# Altium project STM32H750-MotherBoard.PrjPcb
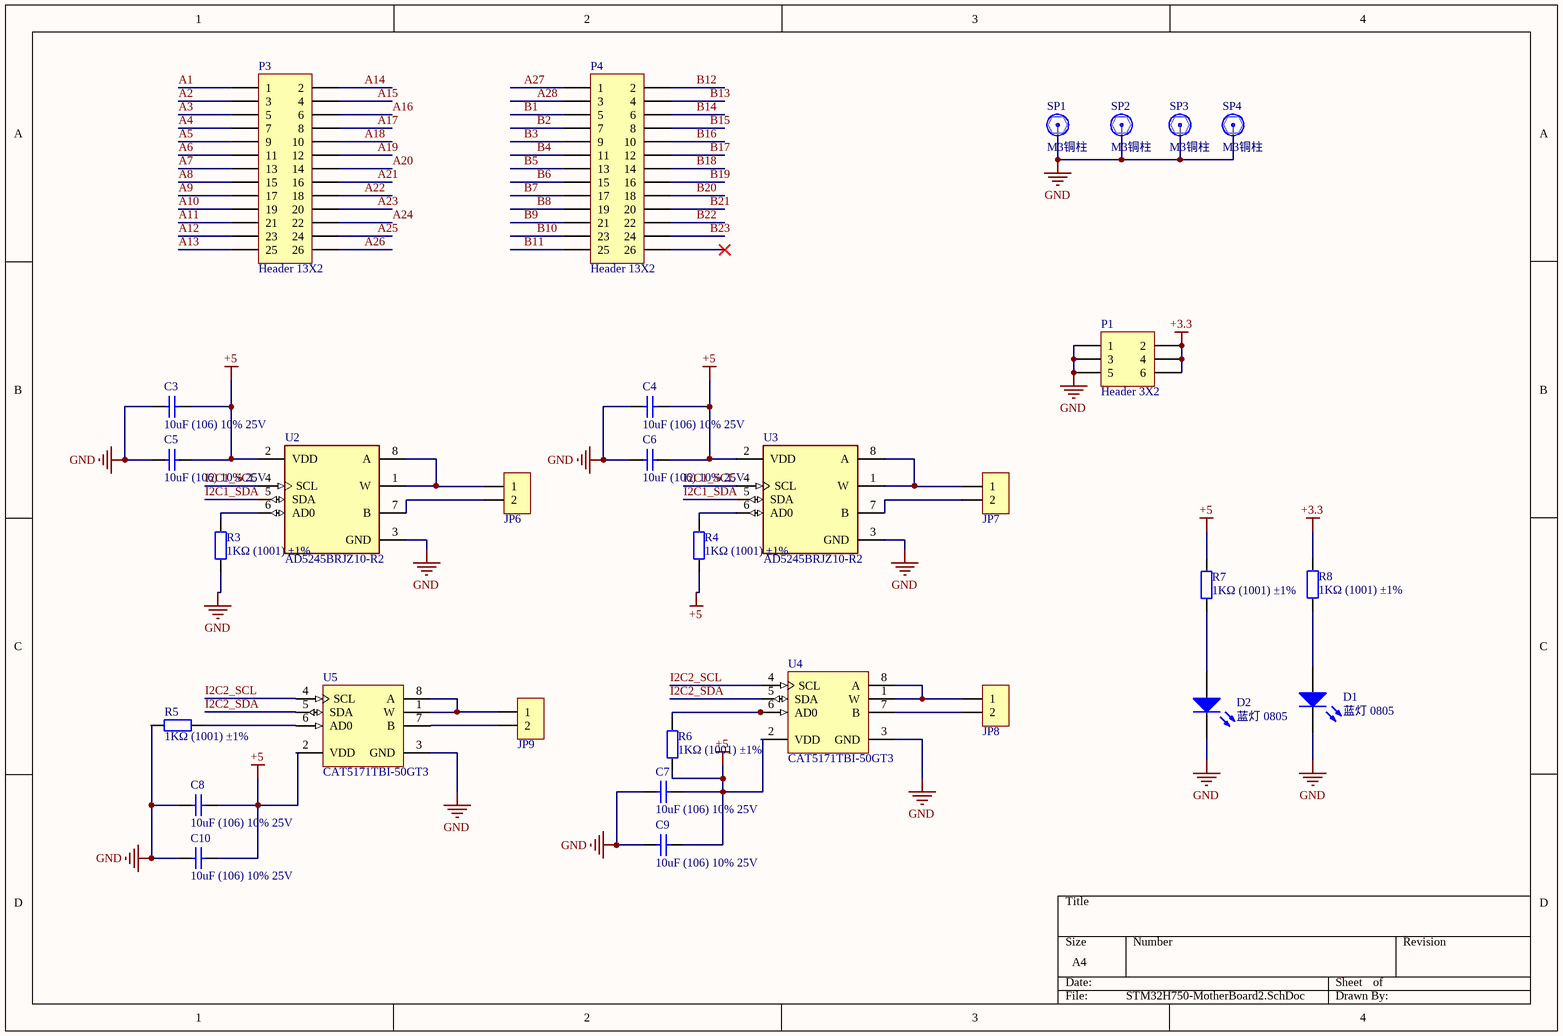
[diagram p0: STM32H750-MotherBoard2.SchDoc]
2 sheets, 45 parts. Net scope: global (net labels, ports and power ports of the same name join across sheets).
Board file: STM32H750-MotherBoard.PcbDoc
Sheets:
  STM32H750-MotherBoard2.SchDoc
  STM32H750-MotherBoard1.SchDoc

## Sheet STM32H750-MotherBoard2.SchDoc
size A4; DocumentNumber: 2; SheetNumber: 2; SheetTotal: 2

### Parts
C3  10uF (106) 10% 25V  [0805_C]
C4  10uF (106) 10% 25V  [0805_C]
C5  10uF (106) 10% 25V  [0805_C]
C6  10uF (106) 10% 25V  [0805_C]
C7  10uF (106) 10% 25V  [0805_C]
C8  10uF (106) 10% 25V  [0805_C]
C9  10uF (106) 10% 25V  [0805_C]
C10  10uF (106) 10% 25V  [0805_C]
D1  蓝灯 0805  [0805_LED_S1]
D2  蓝灯 0805  [0805_LED_S1]
JP6  HDR-1X2  [XH2.54-LI-2P]  (value not drawn)
JP7  HDR-1X2  [XH2.54-LI-2P]  (value not drawn)
JP8  HDR-1X2  [XH2.54-LI-2P]  (value not drawn)
JP9  HDR-1X2  [XH2.54-LI-2P]  (value not drawn)
P1  Header 3X2  [HDR2X3]
P3  Header 13X2  [HDR2X13]
P4  Header 13X2  [HDR2X13]
R3  1KΩ (1001) ±1%  [0805_R]
R4  1KΩ (1001) ±1%  [0805_R]
R5  1KΩ (1001) ±1%  [0805_R]
R6  1KΩ (1001) ±1%  [0805_R]
R7  1KΩ (1001) ±1%  [0805_R]
R8  1KΩ (1001) ±1%  [0805_R]
SP1  M3铜柱  [M3x4_L]
SP2  M3铜柱  [M3x4_L]
SP3  M3铜柱  [M3x4_L]
SP4  M3铜柱  [M3x4_L]
U2  AD5245BRJZ10-R2  [FP-RJ-8-IPC_C]
U3  AD5245BRJZ10-R2  [FP-RJ-8-IPC_C]
U4  CAT5171TBI-50GT3  [ONSC-SOT23-8-527AK-01_N]
U5  CAT5171TBI-50GT3  [ONSC-SOT23-8-527AK-01_N]

### Nets
+3.3: P1.2 P1.4 P1.6 R8.2
+5: C3.2 C4.2 C5.2 C6.2 C7.2 C8.2 C9.2 C10.2 R4.1 R6.1 R7.2 U2.2(VDD) U3.2(VDD) U4.2(VDD) U5.2(VDD)
GND: C3.1 C4.1 C5.1 C6.1 C7.1 C8.1 C9.1 C10.1 D1.K D2.K P1.1 P1.3 P1.5 R3.1 R5.1 SP1.1 SP2.1 SP3.1 SP4.1 U2.3(GND) U3.3(GND) U4.3(GND) U5.3(GND)
A1: P3.1
A2: P3.3
A3: P3.5
A4: P3.7
A5: P3.9
A6: P3.11
A7: P3.13
A8: P3.15
A9: P3.17
A10: P3.19
A11: P3.21
A12: P3.23
A13: P3.25
A14: P3.2
A15: P3.4
A16: P3.6
A17: P3.8
A18: P3.10
A19: P3.12
A20: P3.14
A21: P3.16
A22: P3.18
A23: P3.20
A24: P3.22
A25: P3.24
A26: P3.26
A27: P4.1
A28: P4.3
B1: P4.5
B2: P4.7
B3: P4.9
B4: P4.11
B5: P4.13
B6: P4.15
B7: P4.17
B8: P4.19
B9: P4.21
B10: P4.23
B11: P4.25
B12: P4.2
B13: P4.4
B14: P4.6
B15: P4.8
B16: P4.10
B17: P4.12
B18: P4.14
B19: P4.16
B20: P4.18
B21: P4.20
B22: P4.22
B23: P4.24
I2C1_SCL: U2.4(SCL) U3.4(SCL)
I2C1_SDA: U2.5(SDA) U3.5(SDA)
I2C2_SCL: U4.4(SCL) U5.4(SCL)
I2C2_SDA: U4.5(SDA) U5.5(SDA)
NetD1_A: D1.A R8.1
NetD2_A: D2.A R7.1
NetJP6_1: JP6.1 U2.1(W) U2.8(A)
NetJP6_2: JP6.2 U2.7(B)
NetJP7_1: JP7.1 U3.1(W) U3.8(A)
NetJP7_2: JP7.2 U3.7(B)
NetJP8_1: JP8.1 U4.1(W) U4.8(A)
NetJP8_2: JP8.2 U4.7(B)
NetJP9_1: JP9.1 U5.1(W) U5.8(A)
NetJP9_2: JP9.2 U5.7(B)
NetR3_2: R3.2 U2.6(AD0)
NetR4_2: R4.2 U3.6(AD0)
NetR5_2: R5.2 U5.6(AD0)
NetR6_2: R6.2 U4.6(AD0)

Not connected (* = marked no-connect by the designer): P4 26*

### Library data of the parts
C3-C10 = 0805 10uF (106) 10% 25V: 贴片电容; ComponentLink1Description: 供应商链接; ComponentLink1URL: http://www.szlcsc.com/product/details_16532.html; Package: 0805; Supplier: LC; SuppliersPartNumber: C15850
D1 D2 = 0805 蓝灯: 发光二极管; ComponentLink1Description: 供应商链接; ComponentLink1URL: http://www.szlcsc.com/product/details_2666.html; Package: 0805; Supplier: LC; SuppliersPartNumber: C2293
JP6-JP9 = Header 2: 2P接插件; BOM名称: 2P接插件
P1 = Header 3X2: Header, 3-Pin, Dual row; LatestRevisionDate: 17-Jul-2002; LatestRevisionNote: Re-released for DXP Platform.; Publisher: Altium Limited
P3 P4 = Header 13X2: Header, 13-Pin, Dual row; LatestRevisionDate: 17-Jul-2002; LatestRevisionNote: Re-released for DXP Platform.; Publisher: Altium Limited
R3-R8 = 0805 1KΩ (1001) 1%: 贴片电阻; ComponentLink1Description: 供应商链接; ComponentLink1URL: http://www.szlcsc.com/product/details_18201.html; Package: 0805; Supplier: LC; SuppliersPartNumber: C17513
SP1-SP4 = 铜柱小焊盘: 铜柱; BOM名称: 铜柱
U2 U3 = CMP-09083-000005-1: IC DGT POT 10KOHM 256TAP SOT23-8; Manufacturer: Analog Devices; Interface: I2C; Nominal Resistance: 10kΩ; Nominal Supply Current: 3uA; Tolerance: 30%; Max Junction Temp: +150°C; Standoff Height: 0.05mm; Number Of Taps: 256; Number Of Circuits: 1; Min Supply Voltage: 2.7V; Max Supply Voltage: 5.5V; Temperature Coefficient: 45ppm/°C; Footprint Url: https://www.analog.com/media/en/package-pcb-resources/package/pkg_pdf/sot-23rj/RJ_8.pdf; Height: 1.45mm; Temperature Range Low: -40°C; Category: IC; Temperature: -40°C to +125°C; ComponentLink2URL: https://www.analog.com/media/en/technical-documentation/data-sheets/AD5245.pdf; Automotive: No; Lead Free: Yes; ComponentLink2Description: Datasheet; Device Class L2: Data Converter ICs; Digikey Description: IC DGT POT 10KOHM 256TAP SOT23-8; Manufacturer Part Number: AD5245BRJZ10-R2; Package: RJ-8; Octopart: https://octopart.com/ad5245brjz10-r2-analog+devices-446714; Ipc Land Pattern Name: SOT65P280X120-8; Device Class L1: Integrated Circuits (ICs); RoHS: TRUE; Temperature Range High: +125°C; Device Class L3: Digital Potentiometers; Mouser Description: Digital Potentiometer ICs IC 256-pos I2C
U4 U5 = CMP-1317-00202-1: 256-Position I2C Compatible Digital Potentiometer (POT), -40 to 85 degC, 8-Pin SOT23, Pb-Free, Tape and Reel; Manufacturer: On Semiconductor; # of Pots: 1; VDD Max (V): 5.5; # of Taps: 256; Code_JEDEC: MO-178; RoHS: TRUE; ComponentLink1URL: http://www.onsemi.com/; ComponentLink3URL: http://www.onsemi.com/pub_link/Collateral/527AK.PDF; PackageDescription: 8-Pin Small Outline Transistor, Body 2.9 x 1.6 mm, Pitch 0.65 mm; ComponentLink3Description: Package Specification; PackageReference: SOT23-8-527AK-01; ComponentLink1Description: Manufacturer URL; PartNumber: CAT5171TBI-50GT3; PackageVersion: Rev. A, 03/2009; Packing: Tape and Reel; DatasheetVersion: Rev. 2; Mounting Technology: Surface Mount; ComponentLink2URL: http://www.onsemi.com/pub_link/Collateral/CAT5171-D.PDF; Control Interface: I2C; Type: Potentiometer; ComponentLink2Description: Datasheet

## Sheet STM32H750-MotherBoard1.SchDoc
size A4; DocumentNumber: 1; SheetNumber: 1; SheetTotal: 2
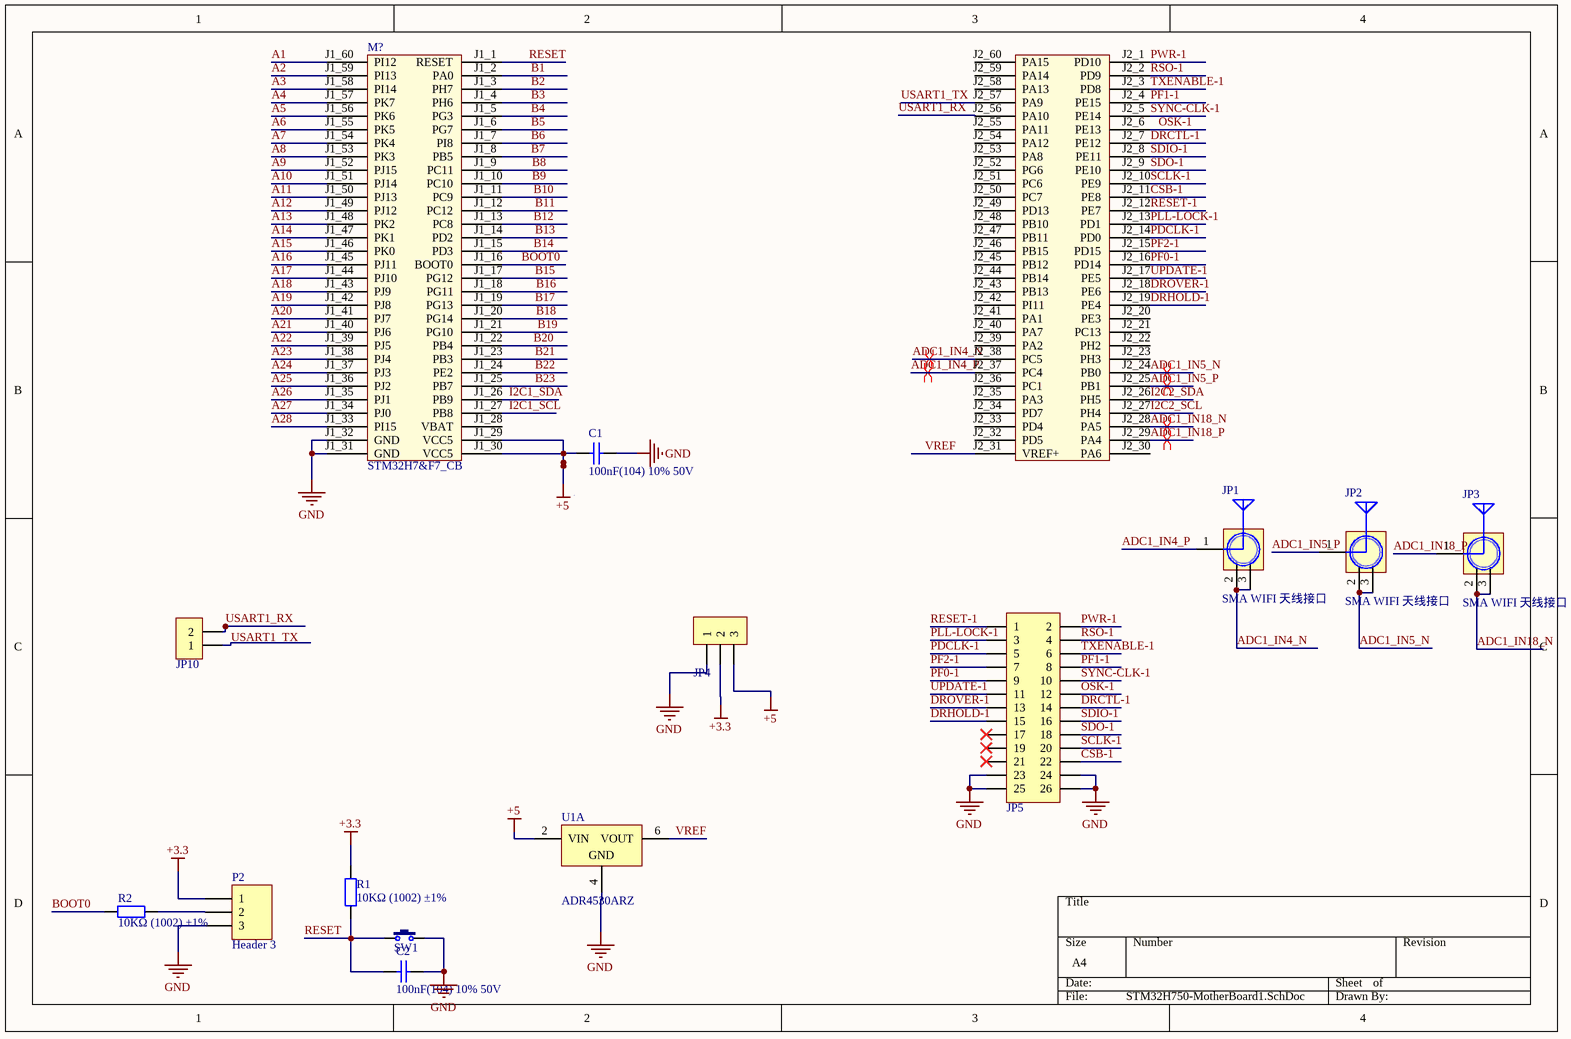
[diagram p1: STM32H750-MotherBoard1.SchDoc]

### Parts
C1  100nF(104) 10% 50V  [0805_C]
C2  100nF(104) 10% 50V  [0805_C]
JP1  SMA WIFI 天线接口  [SMA-KE]
JP2  SMA WIFI 天线接口  [SMA-KE]
JP3  SMA WIFI 天线接口  [SMA-KE]
JP4  HDR-1X3  [XH2.54-WI-3P]  (value not drawn)
JP5  Header 2X11  [IDC2.54-LI-2x13P]  (value not drawn)
JP10  HDR-1X2  [XH2.54-LI-2P]  (value not drawn)
M?  STM32H7&F7_CB  [STM32H7&F7_CB]
P2  Header 3  [HDR1X3]
R1  10KΩ (1002) ±1%  [0805_R]
R2  10KΩ (1002) ±1%  [0805_R]
SW1  3x6x5  [TSW SMD-3*6*2.5]  (value not drawn)
U1  ADR4530ARZ  [ADI-R-8_L]  (part A of 2)

### Nets
+3.3: JP4.2 P2.1 R1.2
+5: C1.2 JP4.3 M?.J1_29(VCC5) M?.J1_30(VCC5) U1.2(VIN)
GND: C1.1 C2.1 JP4.1 JP5.23 JP5.24 JP5.25 JP5.26 M?.J1_31(GND) M?.J1_32(GND) P2.3 SW1.2 U1.4(GND)
A1: M?.J1_60(PI12)
A2: M?.J1_59(PI13)
A3: M?.J1_58(PI14)
A4: M?.J1_57(PK7)
A5: M?.J1_56(PK6)
A6: M?.J1_55(PK5)
A7: M?.J1_54(PK4)
A8: M?.J1_53(PK3)
A9: M?.J1_52(PJ15)
A10: M?.J1_51(PJ14)
A11: M?.J1_50(PJ13)
A12: M?.J1_49(PJ12)
A13: M?.J1_48(PK2)
A14: M?.J1_47(PK1)
A15: M?.J1_46(PK0)
A16: M?.J1_45(PJ11)
A17: M?.J1_44(PJ10)
A18: M?.J1_43(PJ9)
A19: M?.J1_42(PJ8)
A20: M?.J1_41(PJ7)
A21: M?.J1_40(PJ6)
A22: M?.J1_39(PJ5)
A23: M?.J1_38(PJ4)
A24: M?.J1_37(PJ3)
A25: M?.J1_36(PJ2)
A26: M?.J1_35(PJ1)
A27: M?.J1_34(PJ0)
A28: M?.J1_33(PI15)
ADC1_IN4_N: JP1.2(GND) JP1.3(GND) M?.J2_38(PC5)
ADC1_IN4_P: JP1.1(ANT) M?.J2_37(PC4)
ADC1_IN5_N: JP2.2(GND) JP2.3(GND) M?.J2_24(PB0)
ADC1_IN5_P: JP2.1(ANT) M?.J2_25(PB1)
ADC1_IN18_N: JP3.2(GND) JP3.3(GND) M?.J2_28(PA5)
ADC1_IN18_P: JP3.1(ANT) M?.J2_29(PA4)
B1: M?.J1_2(PA0)
B2: M?.J1_3(PH7)
B3: M?.J1_4(PH6)
B4: M?.J1_5(PG3)
B5: M?.J1_6(PG7)
B6: M?.J1_7(PI8)
B7: M?.J1_8(PB5)
B8: M?.J1_9(PC11)
B9: M?.J1_10(PC10)
B10: M?.J1_11(PC9)
B11: M?.J1_12(PC12)
B12: M?.J1_13(PC8)
B13: M?.J1_14(PD2)
B14: M?.J1_15(PD3)
B15: M?.J1_17(PG12)
B16: M?.J1_18(PG11)
B17: M?.J1_19(PG13)
B18: M?.J1_20(PG14)
B19: M?.J1_21(PG10)
B20: M?.J1_22(PB4)
B21: M?.J1_23(PB3)
B22: M?.J1_24(PE2)
B23: M?.J1_25(PB7)
BOOT0: M?.J1_16(BOOT0) R2.1
CSB-1: JP5.22 M?.J2_11(PE8)
DRCTL-1: JP5.14 M?.J2_7(PE12)
DRHOLD-1: JP5.15 M?.J2_19(PE4)
DROVER-1: JP5.13 M?.J2_18(PE6)
I2C1_SCL: M?.J1_27(PB8)
I2C1_SDA: M?.J1_26(PB9)
I2C2_SCL: M?.J2_27(PH4)
I2C2_SDA: M?.J2_26(PH5)
OSK-1: JP5.12 M?.J2_6(PE13)
PDCLK-1: JP5.5 M?.J2_14(PD0)
PF0-1: JP5.9 M?.J2_16(PD14)
PF1-1: JP5.8 M?.J2_4(PE15)
PF2-1: JP5.7 M?.J2_15(PD15)
PLL-LOCK-1: JP5.3 M?.J2_13(PD1)
PWR-1: JP5.2 M?.J2_1(PD10)
RESET: C2.2 M?.J1_1(RESET) R1.1 SW1.1
RESET-1: JP5.1 M?.J2_12(PE7)
RSO-1: JP5.4 M?.J2_2(PD9)
SCLK-1: JP5.20 M?.J2_10(PE9)
SDIO-1: JP5.16 M?.J2_8(PE11)
SDO-1: JP5.18 M?.J2_9(PE10)
SYNC-CLK-1: JP5.10 M?.J2_5(PE14)
TXENABLE-1: JP5.6 M?.J2_3(PD8)
UPDATE-1: JP5.11 M?.J2_17(PE5)
USART1_RX: JP10.2 M?.J2_56(PA10)
USART1_TX: JP10.1 M?.J2_57(PA9)
VREF: M?.J2_31(VREF+) U1.6(VOUT)
NetP2_2: P2.2 R2.2

Not connected (* = marked no-connect by the designer): JP5 17* 19* 21*; M? J1_28(VBAT) J2_20(PE3) J2_21(PC13) J2_22(PH2) J2_23(PH3) J2_30(PA6) J2_32(PD5) J2_33(PD4) J2_34(PD7) J2_35(PA3) J2_36(PC1) J2_39(PA2) J2_40(PA7) J2_41(PA1) J2_42(PI11) J2_43(PB13) J2_44(PB14) J2_45(PB12) J2_46(PB15) J2_47(PB11) J2_48(PB10) J2_49(PD13) J2_50(PC7) J2_51(PC6) J2_52(PG6) J2_53(PA8) J2_54(PA12) J2_55(PA11) J2_58(PA13) J2_59(PA14) J2_60(PA15)

### Layout directives
differential pair: ADC1_IN4_N, ADC1_IN4_P, ADC1_IN5_N, ADC1_IN5_P, ADC1_IN18_N, ADC1_IN18_P

### Library data of the parts
C1 C2 = 0805 100nF(104) 10% 50V: 贴片电容; ComponentLink1Description: 供应商链接; ComponentLink1URL: http://www.szlcsc.com/product/details_50686.html; Package: 0805; Supplier: LC; SuppliersPartNumber: C49678
JP1-JP3 = SMA: SMA-2.4G射频天线接口; BOM名称: SMA-2.4G射频天线接口
JP4 = Header 3: 3P接插件; BOM名称: 3P接插件
JP5 = Header 13X2: 13*2P接插件; BOM名称: 13*2P接插件
JP10 = Header 2: 2P接插件; BOM名称: 2P接插件
M? = STM32H7&F7_CB: H750/F750 Core Board
P2 = Header 3: Header, 3-Pin; LatestRevisionDate: 17-Jul-2002; LatestRevisionNote: Re-released for DXP Platform.; Publisher: Altium Limited
R1 R2 = 0805 10KΩ (1002) 1%: 贴片电阻; ComponentLink1Description: 供应商链接; ComponentLink1URL: http://www.szlcsc.com/product/details_18102.html; Package: 0805; Supplier: LC; SuppliersPartNumber: C17414
SW1 = TSW 3x6: 3x6轻触开关; BOM名称: 3x6轻触开关
U1 = CMP-0784-00168-1: Ultralow Noise, High Accuracy Voltage Reference, 3 V Output, 3 to 15 V Supply, Industrial, 8-pin SOIC (R-8), Tube; Manufacturer: Analog Devices; Vout: 3V; Min V Supply (V): 3; Ref Out TC (ppm/C): 4; Max V Supply (V): 15; Packing: Tube; ComponentLink1Description: Manufacturer URL; Operating Temp Range: -40 to 125 degC; ComponentLink3Description: Package Specification; PackageReference: R-8; ComponentLink1URL: http://www.analog.com/en/index.html; PackageVersion: 060506-A, 06/2006; PartNumber: ADR4530ARZ; Code_JEDEC: MS-012-AA; ComponentLink4URL: Product URL:http://www.analog.com/en/special-linear-functions/voltage-references/adr4530/products/product.html; ComponentLink2URL: http://www.analog.com/static/imported-files/data_sheets/ADR4520_4525_4530_4533_4540_4550.pdf; PackageDescription: 8-Pin Standard Small Outline Package, Body 4.9 x 3.9 mm, Pitch 1.27 mm; ComponentLink2Description: Datasheet; Mounting Technology: Surface Mount; ComponentLink3URL: http://www.analog.com/static/imported-files/packages/PKG_PDF/SOIC_Narrow%20(R)/R_8.pdf; DatasheetVersion: Rev. 0; ComponentLink4Description: URL Link1

## Nets that join several sheets
+3.3: STM32H750-MotherBoard2 (P1.2 P1.4 P1.6 R8.2), STM32H750-MotherBoard1 (JP4.2 P2.1 R1.2)
+5: STM32H750-MotherBoard2 (15 pins), STM32H750-MotherBoard1 (5 pins)
GND: STM32H750-MotherBoard2 (23 pins), STM32H750-MotherBoard1 (12 pins)
A1: STM32H750-MotherBoard2 (P3.1), STM32H750-MotherBoard1 (M?.J1_60)
A2: STM32H750-MotherBoard2 (P3.3), STM32H750-MotherBoard1 (M?.J1_59)
A3: STM32H750-MotherBoard2 (P3.5), STM32H750-MotherBoard1 (M?.J1_58)
A4: STM32H750-MotherBoard2 (P3.7), STM32H750-MotherBoard1 (M?.J1_57)
A5: STM32H750-MotherBoard2 (P3.9), STM32H750-MotherBoard1 (M?.J1_56)
A6: STM32H750-MotherBoard2 (P3.11), STM32H750-MotherBoard1 (M?.J1_55)
A7: STM32H750-MotherBoard2 (P3.13), STM32H750-MotherBoard1 (M?.J1_54)
A8: STM32H750-MotherBoard2 (P3.15), STM32H750-MotherBoard1 (M?.J1_53)
A9: STM32H750-MotherBoard2 (P3.17), STM32H750-MotherBoard1 (M?.J1_52)
A10: STM32H750-MotherBoard2 (P3.19), STM32H750-MotherBoard1 (M?.J1_51)
A11: STM32H750-MotherBoard2 (P3.21), STM32H750-MotherBoard1 (M?.J1_50)
A12: STM32H750-MotherBoard2 (P3.23), STM32H750-MotherBoard1 (M?.J1_49)
A13: STM32H750-MotherBoard2 (P3.25), STM32H750-MotherBoard1 (M?.J1_48)
A14: STM32H750-MotherBoard2 (P3.2), STM32H750-MotherBoard1 (M?.J1_47)
A15: STM32H750-MotherBoard2 (P3.4), STM32H750-MotherBoard1 (M?.J1_46)
A16: STM32H750-MotherBoard2 (P3.6), STM32H750-MotherBoard1 (M?.J1_45)
A17: STM32H750-MotherBoard2 (P3.8), STM32H750-MotherBoard1 (M?.J1_44)
A18: STM32H750-MotherBoard2 (P3.10), STM32H750-MotherBoard1 (M?.J1_43)
A19: STM32H750-MotherBoard2 (P3.12), STM32H750-MotherBoard1 (M?.J1_42)
A20: STM32H750-MotherBoard2 (P3.14), STM32H750-MotherBoard1 (M?.J1_41)
A21: STM32H750-MotherBoard2 (P3.16), STM32H750-MotherBoard1 (M?.J1_40)
A22: STM32H750-MotherBoard2 (P3.18), STM32H750-MotherBoard1 (M?.J1_39)
A23: STM32H750-MotherBoard2 (P3.20), STM32H750-MotherBoard1 (M?.J1_38)
A24: STM32H750-MotherBoard2 (P3.22), STM32H750-MotherBoard1 (M?.J1_37)
A25: STM32H750-MotherBoard2 (P3.24), STM32H750-MotherBoard1 (M?.J1_36)
A26: STM32H750-MotherBoard2 (P3.26), STM32H750-MotherBoard1 (M?.J1_35)
A27: STM32H750-MotherBoard2 (P4.1), STM32H750-MotherBoard1 (M?.J1_34)
A28: STM32H750-MotherBoard2 (P4.3), STM32H750-MotherBoard1 (M?.J1_33)
B1: STM32H750-MotherBoard2 (P4.5), STM32H750-MotherBoard1 (M?.J1_2)
B2: STM32H750-MotherBoard2 (P4.7), STM32H750-MotherBoard1 (M?.J1_3)
B3: STM32H750-MotherBoard2 (P4.9), STM32H750-MotherBoard1 (M?.J1_4)
B4: STM32H750-MotherBoard2 (P4.11), STM32H750-MotherBoard1 (M?.J1_5)
B5: STM32H750-MotherBoard2 (P4.13), STM32H750-MotherBoard1 (M?.J1_6)
B6: STM32H750-MotherBoard2 (P4.15), STM32H750-MotherBoard1 (M?.J1_7)
B7: STM32H750-MotherBoard2 (P4.17), STM32H750-MotherBoard1 (M?.J1_8)
B8: STM32H750-MotherBoard2 (P4.19), STM32H750-MotherBoard1 (M?.J1_9)
B9: STM32H750-MotherBoard2 (P4.21), STM32H750-MotherBoard1 (M?.J1_10)
B10: STM32H750-MotherBoard2 (P4.23), STM32H750-MotherBoard1 (M?.J1_11)
B11: STM32H750-MotherBoard2 (P4.25), STM32H750-MotherBoard1 (M?.J1_12)
B12: STM32H750-MotherBoard2 (P4.2), STM32H750-MotherBoard1 (M?.J1_13)
B13: STM32H750-MotherBoard2 (P4.4), STM32H750-MotherBoard1 (M?.J1_14)
B14: STM32H750-MotherBoard2 (P4.6), STM32H750-MotherBoard1 (M?.J1_15)
B15: STM32H750-MotherBoard2 (P4.8), STM32H750-MotherBoard1 (M?.J1_17)
B16: STM32H750-MotherBoard2 (P4.10), STM32H750-MotherBoard1 (M?.J1_18)
B17: STM32H750-MotherBoard2 (P4.12), STM32H750-MotherBoard1 (M?.J1_19)
B18: STM32H750-MotherBoard2 (P4.14), STM32H750-MotherBoard1 (M?.J1_20)
B19: STM32H750-MotherBoard2 (P4.16), STM32H750-MotherBoard1 (M?.J1_21)
B20: STM32H750-MotherBoard2 (P4.18), STM32H750-MotherBoard1 (M?.J1_22)
B21: STM32H750-MotherBoard2 (P4.20), STM32H750-MotherBoard1 (M?.J1_23)
B22: STM32H750-MotherBoard2 (P4.22), STM32H750-MotherBoard1 (M?.J1_24)
B23: STM32H750-MotherBoard2 (P4.24), STM32H750-MotherBoard1 (M?.J1_25)
I2C1_SCL: STM32H750-MotherBoard2 (U2.4 U3.4), STM32H750-MotherBoard1 (M?.J1_27)
I2C1_SDA: STM32H750-MotherBoard2 (U2.5 U3.5), STM32H750-MotherBoard1 (M?.J1_26)
I2C2_SCL: STM32H750-MotherBoard2 (U4.4 U5.4), STM32H750-MotherBoard1 (M?.J2_27)
I2C2_SDA: STM32H750-MotherBoard2 (U4.5 U5.5), STM32H750-MotherBoard1 (M?.J2_26)